# EAGLE design dmx-led-dimmer (EAGLE 5.11)
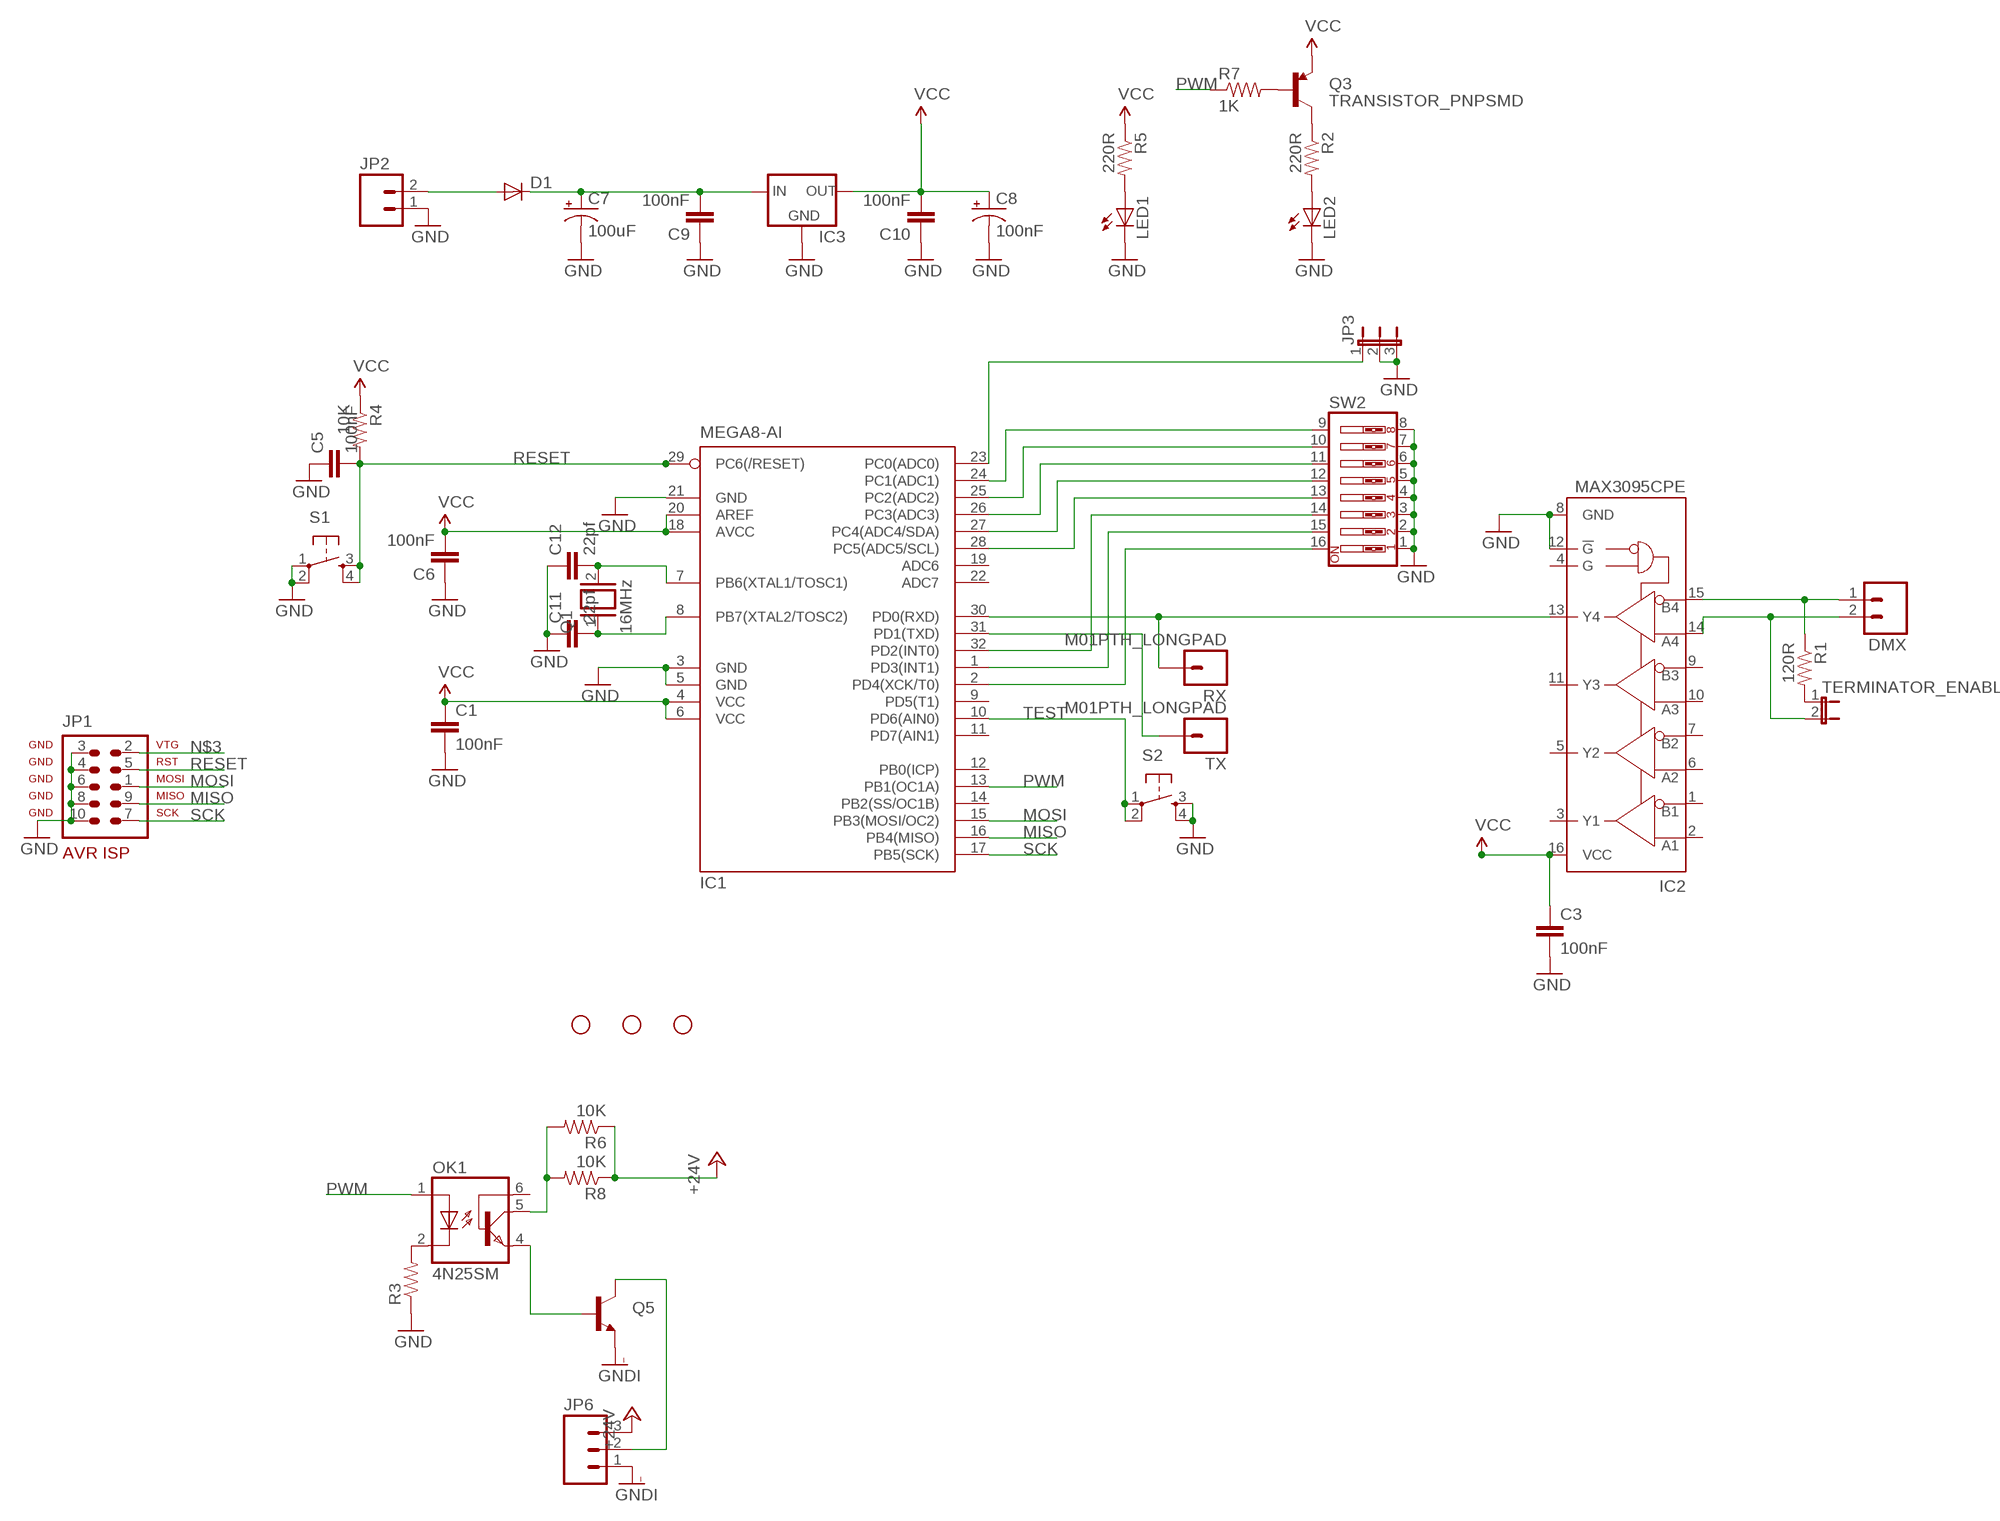
[diagram p0: schematic, sheet 1]

## Parts
C1  100nF  CAP0805  [0805]
C3  100nF  CAP0805  [0805]
C5  100nF  CAP0805  [0805]
C6  100nF  CAP0805  [0805]
C7  100uF  CAP_POLPTH1  [CPOL-RADIAL-100UF-25V]
C8  100nF  CAP_POLPTH1  [CPOL-RADIAL-100UF-25V]
C9  100nF  CAP0805  [0805]
C10  100nF  CAP0805  [0805]
C11  22pf  CAP0805  [0805]
C12  22pf  CAP0805  [0805]
D1  DIODESMA-KIT  [SMA-DIODE-KIT]
DMX  M02LOCK_LONGPADS  [1X02_LOCK_LONGPADS]
IC1  MEGA8-AI  [TQFP32-08]
IC2  MAX3095CPE  [DIL16]
IC3  V_REG_78XXSINK  [TO220-IGO]
JP1  AVR-ISP-10  [AVR-ISP-10]
JP2  M02LOCK_LONGPADS  [1X02_LOCK_LONGPADS]
JP3  JP2E  [JP2]
JP4  STAND-OFF  [STAND-OFF]
JP5  STAND-OFF  [STAND-OFF]
JP6  M03LONGPADS  [1X03_LONGPADS]
JP8  STAND-OFF  [STAND-OFF]
LED1  LED5MM  [LED5MM]
LED2  LED5MM  [LED5MM]
OK1  4N25SM  [DIL6-SMD]
Q1  16MHz  XTAL/S  [QS]
Q3  TRANSISTOR_PNPSMD  [SOT23-3]
Q5  TRANSISTOR_NPNSOT23  [SOT23]
R1  120R  RESISTOR0805-RES  [0805]
R2  220R  RESISTOR0805-RES  [0805]
R3  RESISTOR0805-RES  [0805]
R4  10K  RESISTOR0805-RES  [0805]
R5  220R  RESISTOR0805-RES  [0805]
R6  10K  RESISTOR0805-RES  [0805]
R7  1K  RESISTOR0805-RES  [0805]
R8  10K  RESISTOR0805-RES  [0805]
RX  M01PTH_LONGPAD  [1X01_LONGPAD]
S1  TAC_SWITCHPTH  [TACTILE-PTH]
S2  TAC_SWITCHPTH  [TACTILE-PTH]
SW2  SW_DIP-8  [EDG-08]
TERMINATOR_ENABLE  JP1E  [JP1]
TX  M01PTH_LONGPAD  [1X01_LONGPAD]

## Nets
+24V: JP6.3 R6.1 R8.1
A: DMX.2 IC2.14(A4) TERMINATOR_ENABLE.2
B: DMX.1 IC2.15(B4) R1.1
GND: C1.2 C3.2 C5.1 C6.1 C7.2(-) C8.2(-) C9.1 C10.1 C11.1 C12.1 IC1.3(GND) IC1.5(GND) IC1.21(GND) IC2.8(GND) IC2.12(!G) IC3.GND JP1.3 JP1.4 JP1.6 JP1.8 JP1.10 JP2.1 JP3.2 JP3.3 LED1.K(C) LED2.K(C) R3.1 S1.1 S1.2 S2.3 S2.4 SW2.1 SW2.2 SW2.3 SW2.4 SW2.5 SW2.6 SW2.7 SW2.8
GNDI: JP6.1 Q5.2(E)
MISO: IC1.16(PB4(MISO)) JP1.9
MOSI: IC1.15(PB3(MOSI/OC2)) JP1.1
N$1: LED1.A R5.2
N$2: R1.2 TERMINATOR_ENABLE.1
N$3: JP1.2
N$4: C11.2 IC1.8(PB7(XTAL2/TOSC2)) Q1.1
N$5: C12.2 IC1.7(PB6(XTAL1/TOSC1)) Q1.2
N$6: D1.A JP2.2
N$7: C7.1(+) C9.2 D1.C IC3.IN
N$8: LED2.A R2.2
N$9: JP6.2 Q5.3(C)
N$11: OK1.2(C) R3.2
N$14: Q3.3(C) R2.1
N$15: Q3.1(B) R7.2
N$16: IC1.28(PC5(ADC5/SCL)) SW2.13
N$17: IC1.27(PC4(ADC4/SDA)) SW2.12
N$18: IC1.32(PD2(INT0)) SW2.14
N$19: IC1.26(PC3(ADC3)) SW2.11
N$20: IC1.25(PC2(ADC2)) SW2.10
N$22: IC1.23(PC0(ADC0)) JP3.1
N$23: IC1.1(PD3(INT1)) SW2.15
N$25: OK1.5(COL) R6.2 R8.2
N$26: OK1.4(EMI) Q5.1(B)
PC1: IC1.24(PC1(ADC1)) SW2.9
PD4: IC1.2(PD4(XCK/T0)) SW2.16
PWM: IC1.13(PB1(OC1A)) OK1.1(A) R7.1
RESET: C5.2 IC1.29(PC6(/RESET)) JP1.5 R4.2 S1.3 S1.4
RX: IC1.30(PD0(RXD)) IC2.13(Y4) RX.1
SCK: IC1.17(PB5(SCK)) JP1.7
TEST: IC1.10(PD6(AIN0)) S2.1 S2.2
TX: IC1.31(PD1(TXD)) TX.1
VCC: C1.1 C3.1 C6.2 C8.1(+) C10.2 IC1.4(VCC) IC1.6(VCC) IC1.18(AVCC) IC1.20(AREF) IC2.16(VCC) IC3.OUT Q3.2(E) R4.1 R5.1
Unconnected: IC1.9(PD5(T1)) IC1.11(PD7(AIN1)) IC1.12(PB0(ICP)) IC1.14(PB2(SS/OC1B)) IC1.19(ADC6) IC1.22(ADC7) IC2.1(B1) IC2.2(A1) IC2.3(Y1) IC2.4(G) IC2.5(Y2) IC2.6(A2) IC2.7(B2) IC2.9(B3) IC2.10(A3) IC2.11(Y3) OK1.6(BAS)

## Library data of the parts
C1 C3 C5 C6 C9-C12 = SparkFun:CAP: Capacitor Standard 0603 ceramic capacitor, and 0.1" leaded capacitor.
C7 C8 = SparkFun:CAP_POL: Capacitor Polarized These are standard SMD and PTH capacitors. Normally 10uF, 47uF, and 100uF in electrolytic and tantalum varieties. Always verify the external diameter of the through hole cap, it varies with capacity, voltage, and manufacturer. The EIA devices should be standard.
D1 = SparkFun:DIODE: Diode These are standard reverse protection diodes and small signal diodes. SMA package can handle up to about 1A. SOD-323 can handle about 200mA. What the SOD-323 package when ordering, there are some mfgs out there that are 5-pin packages.
DMX JP2 = SparkFun:M02: Header 2 Standard 2-pin 0.1" header. Use with straight break away headers (SKU : PRT-00116), right angle break away headers (PRT-00553), swiss pins (PRT-00743), machine pins (PRT-00117), and female headers (PRT-00115). Molex polarized connector foot print use with SKU : PRT-08233 with associated crimp pins and housings.
IC1 = atmel:MEGA8: MICROCONTROLLER 8 Kbytes FLASH, 1 kbytes SRAM, 512 bytes EEPROM, USART, 6-channel 10 bit ADC, 2-channel 8 bit ADC Pin compatible with Atmega48, ATMega88, ATMega168 Source: avr.lbr; MPN: ATMEGA8-16AU; OC_FARNELL: 9171371; OC_NEWARK: 73M8863
IC2 = maxim:MAX309*: ±15kV ESD-Protected, 10Mbps, 3V/5V, Quad RS-422/RS-485 Receivers Source: http://pdfserv.maxim-ic.com/en/ds/MAX3095-MAX3096.pdf; MF: MAXIM; MPN: MAX3095CPE+; OC_FARNELL: 9723919; OC_NEWARK: 67K4750
IC3 = SparkFun:V_REG_78XX: Voltage Regulator Standard 7805 5V regulator. IGO (Input Ground Output). Spark Fun Electronics SKU : COM-00107
JP1 = avr-5:AVR-ISP-10: AVR ISP-10 Serial Programming Header
JP3 = jumper:JP2E: JUMPER
JP4 JP5 JP8 = SparkFun:STAND-OFF: Stand Off This is the mechanical footprint for a #4 phillips button head screw. Use the keepout ring to avoid running the screw head into surrounding components. SKU : PRT-00447
JP6 = SparkFun:M03: Header 3 Standard 3-pin 0.1" header. Use with straight break away headers (SKU : PRT-00116), right angle break away headers (PRT-00553), swiss pins (PRT-00743), machine pins (PRT-00117), and female headers (PRT-00115). Molex polarized connector foot print use with SKU : PRT-08232 with associated crimp pins and housings.
LED1 LED2 = SparkFun:LED: LEDs Standard schematic elements and footprints for 5mm, 3mm, 1206, and 0603 sized LEDs. 5mm - Spark Fun Electronics SKU : COM-00529 (and others)
OK1 = optocoupler:4N*?M: General Purpose 6-Pin Phototransistor Optocouplers Source: http://www.fairchildsemi.com/ds/4N/4N35-M.pdf; MF: FAIRCHILD SEMICONDUCTOR; MPN: 4N25SM; OC_FARNELL: 1021152; OC_NEWARK: 34C2020
Q1 = special:XTAL/S: CRYSTAL
Q3 = SparkFun:TRANSISTOR_PNP
Q5 = SparkFun:TRANSISTOR_NPN: Transistor NPN BJT configuration in SOT23 package. MMBT2222 is the common NPN we use. Double check BCE configuration again layout.
R1-R8 = SparkFun:RESISTOR: Resistor Basic schematic elements and footprints for 0603, 1206, and PTH resistors.
RX TX = SparkFun:M01: Header 1 Standard 1-pin 0.1" header. Use with straight break away headers (SKU : PRT-00116), right angle break away headers (PRT-00553), swiss pins (PRT-00743), machine pins (PRT-00117), and female headers (PRT-00115).
S1 S2 = SparkFun:TAC_SWITCH: Momentary Switch Button commonly used for reset or general input. Spark Fun Electronics SKU : COM-00097
SW2 = special:SW_DIP-8: DIP SWITCH
TERMINATOR_ENABLE = jumper:JP1E: JUMPER

## Board
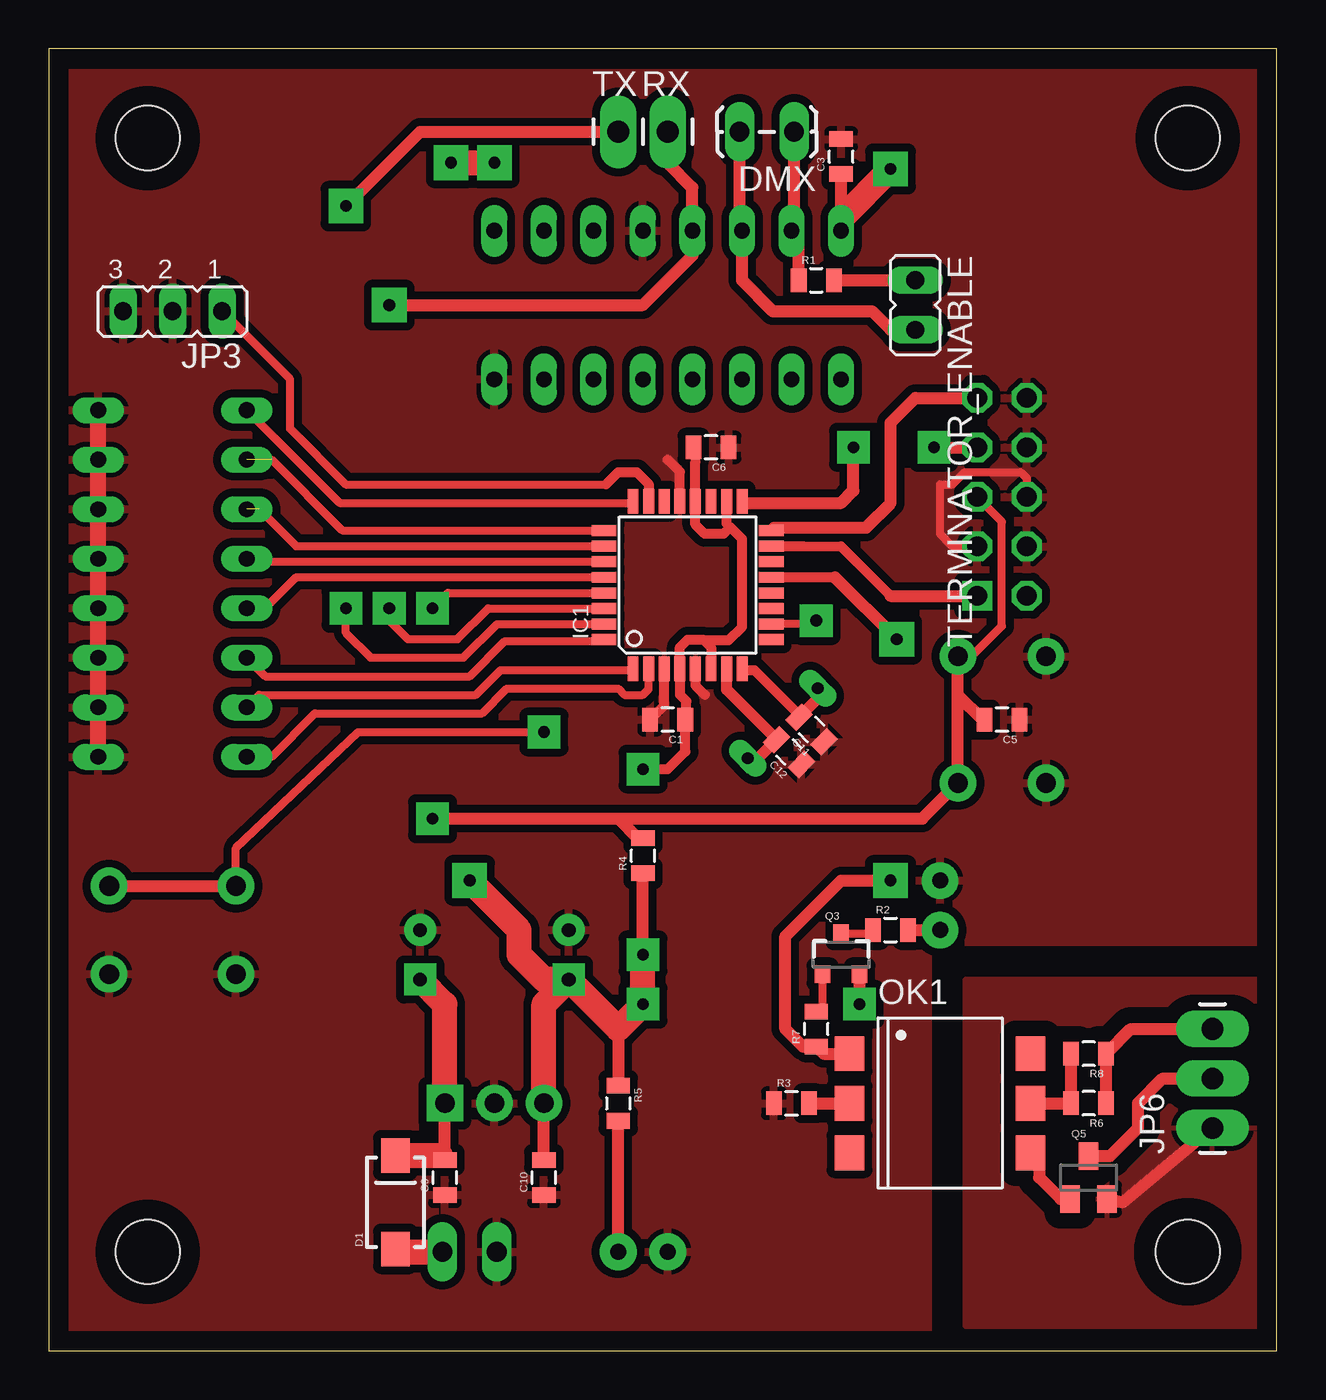
[diagram p1: board, top side]
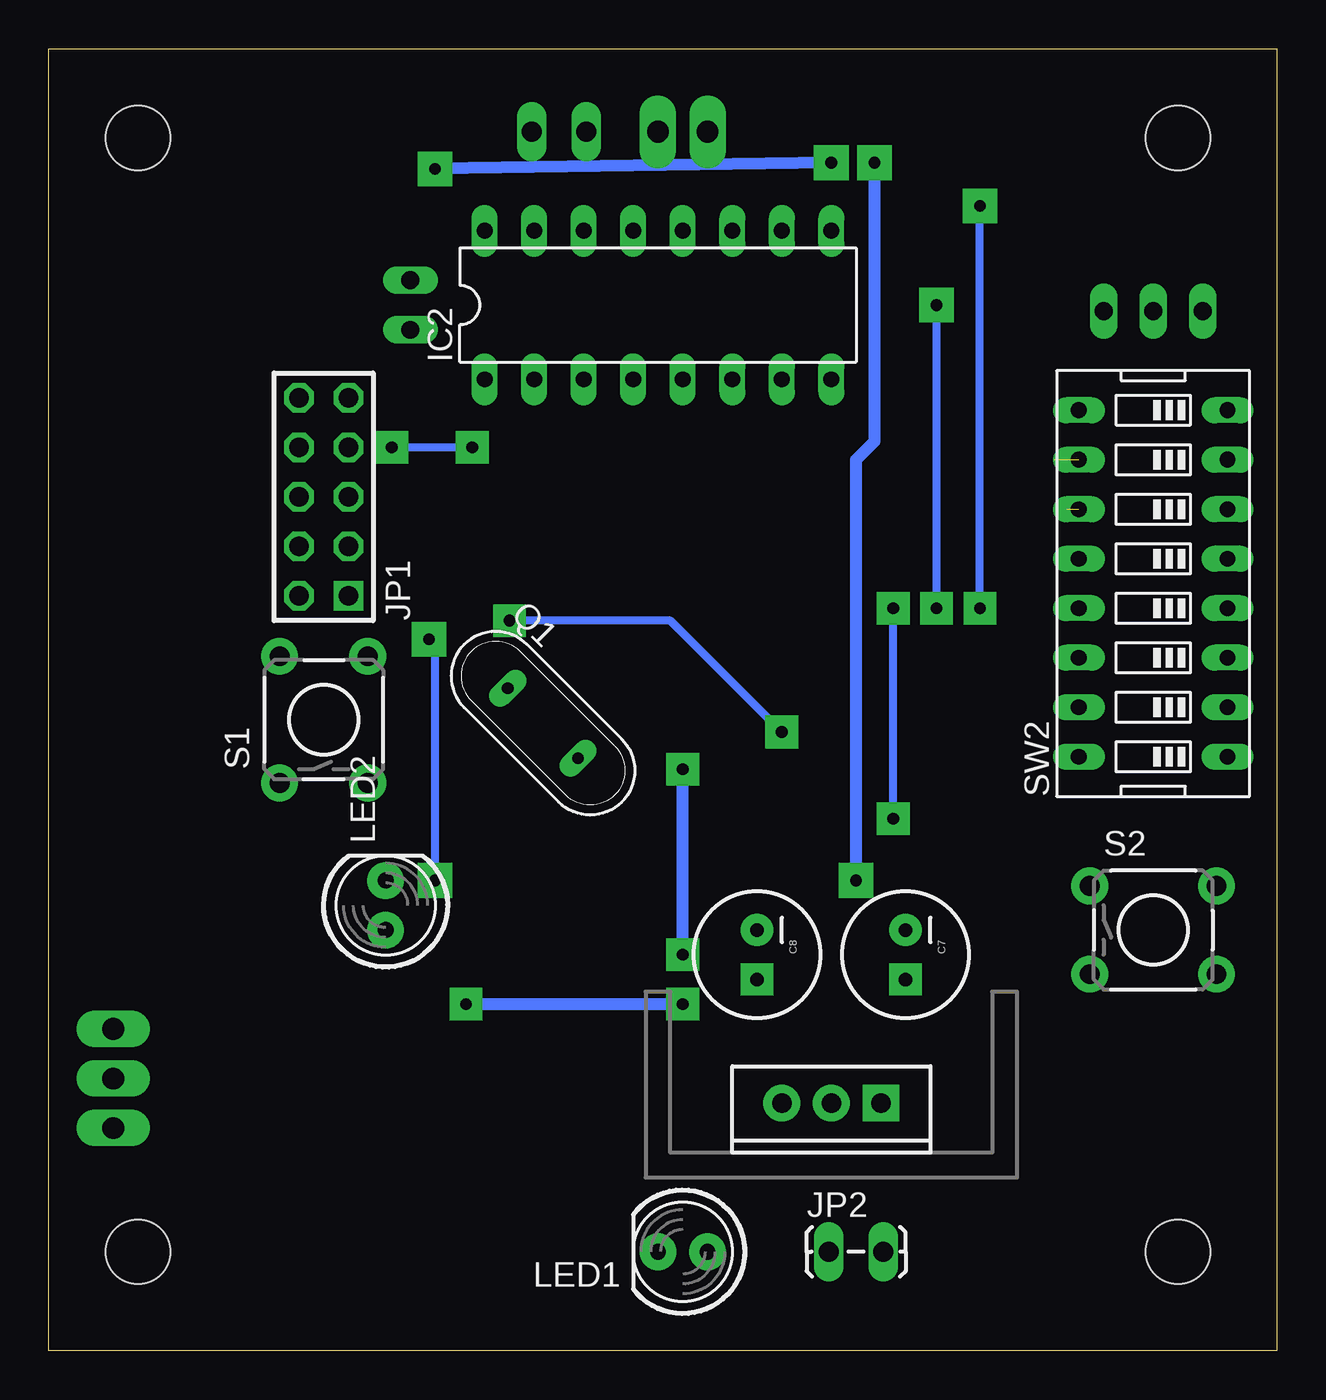
[diagram p2: board, bottom side, seen from below]

Size 63 x 66.81 mm. Coordinates in mm from the lower left corner, seen from the top.
Outline: 0,0 63,0 63,66.81 0,66.81 0,0
Copper layers (1*16): Top 0.035mm / dielectric 1.5mm / Bottom 0.035mm
Design rules "default": minimum track width 10mil, minimum drill 24mil, track to track 8mil, track to pad 8mil, pad to pad 8mil, via to via 8mil, smd to smd 8mil, copper to edge 40mil, drill to drill 8mil, minimum pad ring 10mil, minimum via ring 8mil, stop-mask expansion 4mil, vias tented up to drill 0mil, thermal gap 10mil

### Footprints (pad centres in the part's own frame; a part is rotated, then mirrored left to right if it is on the bottom)
0805 = smd 0.8 x 1.2: 1 -0.9,0; 2 0.9,0
CPOL-RADIAL-100UF-25V = drill 0.7 pad 1.651 square: 1 1.27,0 | drill 0.7 pad 1.651 round: 2 -1.27,0
SMA-DIODE-KIT = smd 1.77 x 1.47: A -2.4,0; C 2.4,0
1X02_LOCK_LONGPADS = drill 1.016 long: 1 -0.127,0; 2 2.667,0
TQFP32-08 = smd 1.27 x 0.559: 1 -4.293,2.8; 2 -4.293,2; 3 -4.293,1.2; 4 -4.293,0.4; 5 -4.293,-0.4; 6 -4.293,-1.2; 7 -4.293,-2; 8 -4.293,-2.8; 17 4.293,-2.8; 18 4.293,-2; 19 4.293,-1.2; 20 4.293,-0.4; 21 4.293,0.4; 22 4.293,1.2; 23 4.293,2; 24 4.293,2.8 | smd 0.559 x 1.27: 9 -2.8,-4.293; 10 -2,-4.293; 11 -1.2,-4.293; 12 -0.4,-4.293; 13 0.4,-4.293; 14 1.2,-4.293; 15 2,-4.293; 16 2.8,-4.293; 25 2.8,4.293; 26 2,4.293; 27 1.2,4.293; 28 0.4,4.293; 29 -0.4,4.293; 30 -1.2,4.293; 31 -2,4.293; 32 -2.8,4.293
DIL16 = drill 0.813 long: 1 -8.89,-3.81; 2 -6.35,-3.81; 3 -3.81,-3.81; 4 -1.27,-3.81; 5 1.27,-3.81; 6 3.81,-3.81; 7 6.35,-3.81; 8 8.89,-3.81; 9 8.89,3.81; 10 6.35,3.81; 11 3.81,3.81; 12 1.27,3.81; 13 -1.27,3.81; 14 -3.81,3.81; 15 -6.35,3.81; 16 -8.89,3.81
TO220-IGO = drill 1 pad 1.88 round: GND 0,0; OUT 2.54,0 | drill 1 pad 1.88 square: IN -2.54,0
AVR-ISP-10 = drill 1.016 square: 1 -5.08,-1.27 | drill 1.016 octagon: 2 -5.08,1.27; 3 -2.54,-1.27; 4 -2.54,1.27; 5 0,-1.27; 6 0,1.27; 7 2.54,-1.27; 8 2.54,1.27; 9 5.08,-1.27; 10 5.08,1.27
JP2 = drill 0.914 long: 1 -2.54,0; 2 0,0; 3 2.54,0
STAND-OFF = hole 3.302: 0,0
1X03_LONGPADS = drill 1.118 pad 1.88 long: 1 0,0; 2 2.54,0; 3 5.08,0
LED5MM = drill 0.813 pad 1.88 round: A -1.27,0; K 1.27,0
DIL6-SMD = smd 1.78 x 1.52: 1 -2.54,-4.645; 2 0,-4.645; 3 2.54,-4.645; 4 2.54,4.645; 5 0,4.645; 6 -2.54,4.645
QS = drill 0.61 long: 1 -2.54,0; 2 2.54,0
SOT23-3 = smd 0.8 x 0.9: 1 -0.95,-1; 2 0.95,-1; 3 0,1.1
SOT23 = smd 1 x 1.4: 1 -0.95,-1.1; 2 0.95,-1.1; 3 0,1.1
1X01_LONGPAD = drill 1.118 pad 1.88 long: 1 0,0
TACTILE-PTH = drill 1.016 pad 1.88 round: 1 -3.251,2.261; 2 3.251,2.261; 3 -3.251,-2.261; 4 3.251,-2.261
EDG-08 = drill 0.813 long: 1 -8.89,-3.81; 2 -6.35,-3.81; 3 -3.81,-3.81; 4 -1.27,-3.81; 5 1.27,-3.81; 6 3.81,-3.81; 7 6.35,-3.81; 8 8.89,-3.81; 9 8.89,3.81; 10 6.35,3.81; 11 3.81,3.81; 12 1.27,3.81; 13 -1.27,3.81; 14 -3.81,3.81; 15 -6.35,3.81; 16 -8.89,3.81
JP1 = drill 0.914 long: 1 0,-1.27; 2 0,1.27

### Placement (x,y rotation side)
C1  31.75,32.38 180 top
C3  40.64,61.28 90 top
C5  48.9,32.38 180 top
C6  33.97,46.35 180 top
C7  19.05,20.32 270 bottom
C8  26.67,20.32 270 bottom
C9  20.32,8.89 90 top
C10  25.4,8.89 90 top
C11  39.13,31.88 135 top
C12  37.97,30.72 135 top
D1  17.78,7.62 90 top
DMX  38.1,62.55 180 top
IC1  32.77,39.29 90 top
IC2  31.75,53.66 0 bottom
IC3  22.86,12.7 180 bottom
JP1  48.9,43.81 90 bottom
JP2  22.86,5.08 0 bottom
JP3  6.35,53.34 180 top
JP4  5.08,62.23 0 top
JP5  5.08,5.08 0 top
JP6  59.69,11.43 90 top
JP8  58.42,5.08 0 top
JP9  STAND-OFF  [STAND-OFF]  58.42,62.23 0 top
LED1  30.48,5.08 180 bottom
LED2  45.72,22.86 90 bottom
OK1  45.72,12.7 270 top
Q1  37.65,32.2 315 bottom
Q3  40.64,20.32 0 top
Q5  53.34,8.89 0 top
R1  39.37,54.93 0 top
R2  43.18,21.59 0 top
R3  38.1,12.7 0 top
R4  30.48,25.4 90 top
R5  29.21,12.7 270 top
R6  53.34,12.7 180 top
R7  39.37,16.51 90 top
R8  53.34,15.24 180 top
RX  31.75,62.55 0 top
S1  48.9,32.38 90 bottom
S2  6.35,21.59 0 bottom
SW2  6.35,39.37 90 bottom
TERMINATOR_ENABLE  44.45,53.66 180 top
TX  29.21,62.55 0 top

### Tracks (layer width: path | path; a pad name or v marks a point on that pad's centre or on a via)
+24V
  Top 0.61: R6.1 R8.1 55.51,16.51 JP6.3
A
  Top 0.406: IC2.14 35.43,57.59 | 43.18,52.39 TERMINATOR_ENABLE.2
  Top 0.61: 35.43,57.59 DMX.2 | IC2.14 35.56,54.93 37.15,53.34 42.23,53.34 43.18,52.39
B
  Top 0.406: 38.23,57.59 IC2.15 38.47,57.1
  Top 0.61: 38.23,57.59 DMX.1 | R1.1 38.47,57.1
GND
  Top 0.406: JP1.3 46.35,41.27 45.72,41.91 45.72,44.45 46.35,44.45 46.99,45.09 49.85,45.09 50.16,44.77 JP1.6
  Top 0.508: IC1.21 32.37,45.1 31.75,45.72 | IC1.5 33.17,34.14 33.66,33.66 | IC1.3 31.57,33.1 C1.2
  Top 0.813: SW2.8 SW2.7 SW2.6 SW2.5 SW2.4 SW2.3 SW2.2 SW2.1
  pour Top (isolate 0.406): 0,66.04 62.23,66.04 62.23,20.95 45.09,20.95 45.09,0 0,0
GNDI
  Top 0.61: JP6.1 55.1,7.62 Q5.2
  pour Top (isolate 0.813): 46.99,19.05 46.99,1.27 62.23,1.27 62.23,19.05
MISO
  Top 0.406: IC1.16 37.2,42.23
  Top 0.61: JP1.9 44.45,48.9 43.18,47.62 43.18,43.5 41.91,42.23 37.2,42.23
MOSI
  Top 0.508: 43.18,38.73 40.64,41.27 38.72,41.29 IC1.15
  Top 0.61: 43.18,38.73 JP1.1
N$1
  Top 0.61: LED1.A R5.2
N$2
  Top 0.61: R1.2 TERMINATOR_ENABLE.1
N$4
  Top 0.508: C11.2 38.49,32.63 36.2,34.92 35.64,34.92 IC1.8
  Top 0.559: C11.2 39.45,33.47 Q1.1
N$5
  Top 0.559: Q1.2 36.38,30.4 C12.2 34.77,33.92 IC1.7
N$6
  Top 0.406: D1.A 17.92,5.08
  Top 1.27: 17.92,5.08 JP2.2
N$7
  Top 0.406: 20.09,10.02 C9.2
  Top 0.61: C9.2 IC3.IN
  Top 1.27: D1.C 20.09,10.02 | IC3.IN 20.32,17.78 C7.1
N$8
  Top 0.61: R2.2 LED2.A
N$9
  Top 0.61: Q5.3 54.44,9.99 55.88,11.43 55.88,12.7 57.15,13.97 JP6.2
N$11
  Top 0.61: R3.2 OK1.2
N$14
  Top 0.406: R2.1 42.11,21.42 Q3.3
N$15
  Top 0.406: Q3.1 39.69,17.73 R7.2
N$16
  Top 0.406: IC1.28 12.7,39.69 11.11,38.1 SW2.13
N$17
  Top 0.406: IC1.27 10.16,40.49 SW2.12
N$18
  Top 0.406: IC1.32 28.48,36.41 23.4,36.41 21.59,34.61 11.11,34.61 SW2.14
N$19  (1 unrouted)
  Top 0.406: IC1.26 12.69,41.29 10.79,43.18
N$20  (1 unrouted)
  Top 0.406: IC1.25 15.06,42.09 11.43,45.72
N$22
  Top 0.406: 28.57,44.45 15.24,44.45 12.38,47.31 12.38,49.85 JP3.1
  Top 0.508: IC1.23 30.77,44.48 30.16,45.09 29.21,45.09 28.57,44.45
N$23
  Top 0.406: IC1.1 29.9,34.92 23.18,34.92 21.91,33.66 10.79,33.66 SW2.15
N$25
  Top 0.61: OK1.5 R6.2 R8.2
N$26
  Top 0.61: Q5.1 51.9,7.79 50.8,8.89 50.8,9.72 OK1.4
PC1
  Top 0.406: IC1.24 29.89,43.5 14.92,43.5 SW2.9
PD4
  Top 0.406: IC1.2 30.77,33.95 30.48,33.66 29.53,33.66 29.21,33.97 23.5,33.97 22.23,32.7 13.65,32.7 11.43,30.48 SW2.16
PWM  (via drill 0.6 pad 1.78)
  Top 0.406: IC1.13
  Top 0.508: 40.32,39.69 IC1.13
  Top 0.61: v43.5,36.51 40.32,39.69 | OK1.1 39.74,15.24 R7.1 38.68,15.61 37.78,16.51 37.78,21.27 40.64,24.13 v43.18,24.13
  Bottom 0.406: v43.5,36.51 43.18,36.2 v43.18,24.13
RESET  (via drill 0.6 pad 1.68)
  Top 0.406: S1.4 46.63,34.92 48.9,37.19 48.9,42.55 JP1.5 | 47.9,32.38 C5.2 | IC1.29 20.48,38.89 v19.68,38.1 | S1.3 46.63,28.85
  Top 0.61: 46.63,33.66 46.63,34.92 | 46.63,33.66 S1.3 44.81,27.3 29.21,27.3 | 46.63,33.66 47.9,32.38 | v19.68,27.3 29.21,27.3 | R4.2 30.21,26.3 29.21,27.3
  Bottom 0.406: v19.68,27.3 v19.68,38.1
RX  (via drill 0.6 pad 1.68, 0.6 pad 1.78)
  Top 0.406: 33.02,56.2 IC2.13 | IC1.30 22.53,38.09 20.95,36.51 18.41,36.51 17.46,37.47 v17.46,38.1
  Top 0.61: v17.46,53.66 30.48,53.66 33.02,56.2 | IC2.13 33.02,59.69 31.75,60.96 RX.1
  Bottom 0.406: v17.46,38.1 v17.46,53.66
SCK  (via drill 0.6 pad 1.68)
  Top 0.406: IC1.17 35.66,43.5
  Top 0.61: v45.4,46.35 JP1.7 | v41.27,46.35 41.27,44.13 40.64,43.5 35.66,43.5
  Bottom 0.406: v41.27,46.35 v45.4,46.35
TEST  (via drill 0.6 pad 1.68)
  Top 0.406: S2.1 9.6,25.79 15.88,31.75 v25.4,31.75 | v39.37,37.47 38.91,37.29 IC1.10
  Top 0.61: S2.2 S2.1
  Bottom 0.406: v25.4,31.75 31.11,37.47 v39.37,37.47
TX  (via drill 0.6 pad 1.68, 0.6 pad 1.78)
  Top 0.406: v15.24,38.1 15.24,36.83 16.51,35.56 21.27,35.56 23,37.29 IC1.31
  Top 0.61: TX.1 19.05,62.55 v15.24,58.74
  Bottom 0.406: v15.24,38.1 v15.24,58.74
VCC  (via drill 0.6 pad 1.68, 0.6 pad 1.78)
  Top 0.406: 33.57,36.49 33.6,36.46 | 33.17,45.62 C6.2 | 34.96,42.26 34.77,42.45
  Top 0.508: IC1.6 33.97,36.09 33.6,36.46 34.87,36.46 35.56,37.15 35.56,41.66 34.96,42.26 34.61,41.91 33.66,41.91 33.17,42.4 IC1.20 33.17,45.62 | 33.57,36.49 32.77,36.49 32.37,36.09 IC1.4 | 34.77,42.45 IC1.18 | 32.38,34.98 32.38,33.66 32.7,33.34 32.7,32.44 C1.1 32.65,30.75 31.75,29.84 v30.48,29.84
  Top 0.559: 32.38,34.98 IC1.4
  Top 0.61: 29.21,16.51 R5.1 | Q3.2 v41.59,17.78 | v30.48,20.32 R4.1 | C10.2 IC3.OUT | IC2.16 C3.1
  Top 1.27: IC3.OUT 25.4,17.78 C8.1 | C8.1 29.21,16.51 v30.48,17.78 v30.48,20.32 | IC2.16 40.64,58.1 v43.18,60.64 | v20.64,60.96 v22.86,60.96 | C8.1 25.4,19.05 24.13,20.32 24.13,21.59 v21.59,24.13
  Bottom 0.61: v30.48,17.78 v41.59,17.78 | v30.48,20.32 v30.48,29.84 | v22.86,60.96 v43.18,60.64 | v20.64,60.96 20.64,46.67 21.59,45.72 v21.59,24.13